# Altium schematic sheet 02_Power1.SchDoc
size A4; DocumentNumber: 2; SheetNumber: 2; SheetTotal: 7
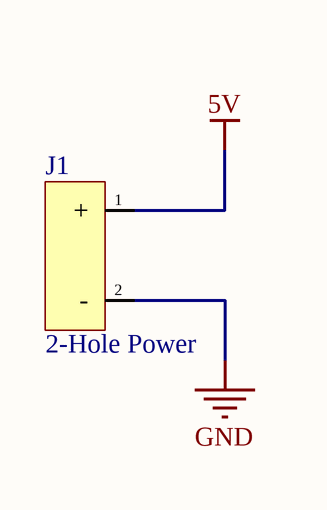
[diagram p0: 02_Power1.SchDoc]

## Parts
J1  2-Hole Power  [2-PIN POWER 5VDC]

## Nets
5V: J1.1(+)
GND: J1.2(-)

## Notes on the sheet
- Title:
- Company:
- Date:
- Sheet
- of
- Drawn By: